# Altium project Do do am_Dk dong co_Hs1101.PrjPcb
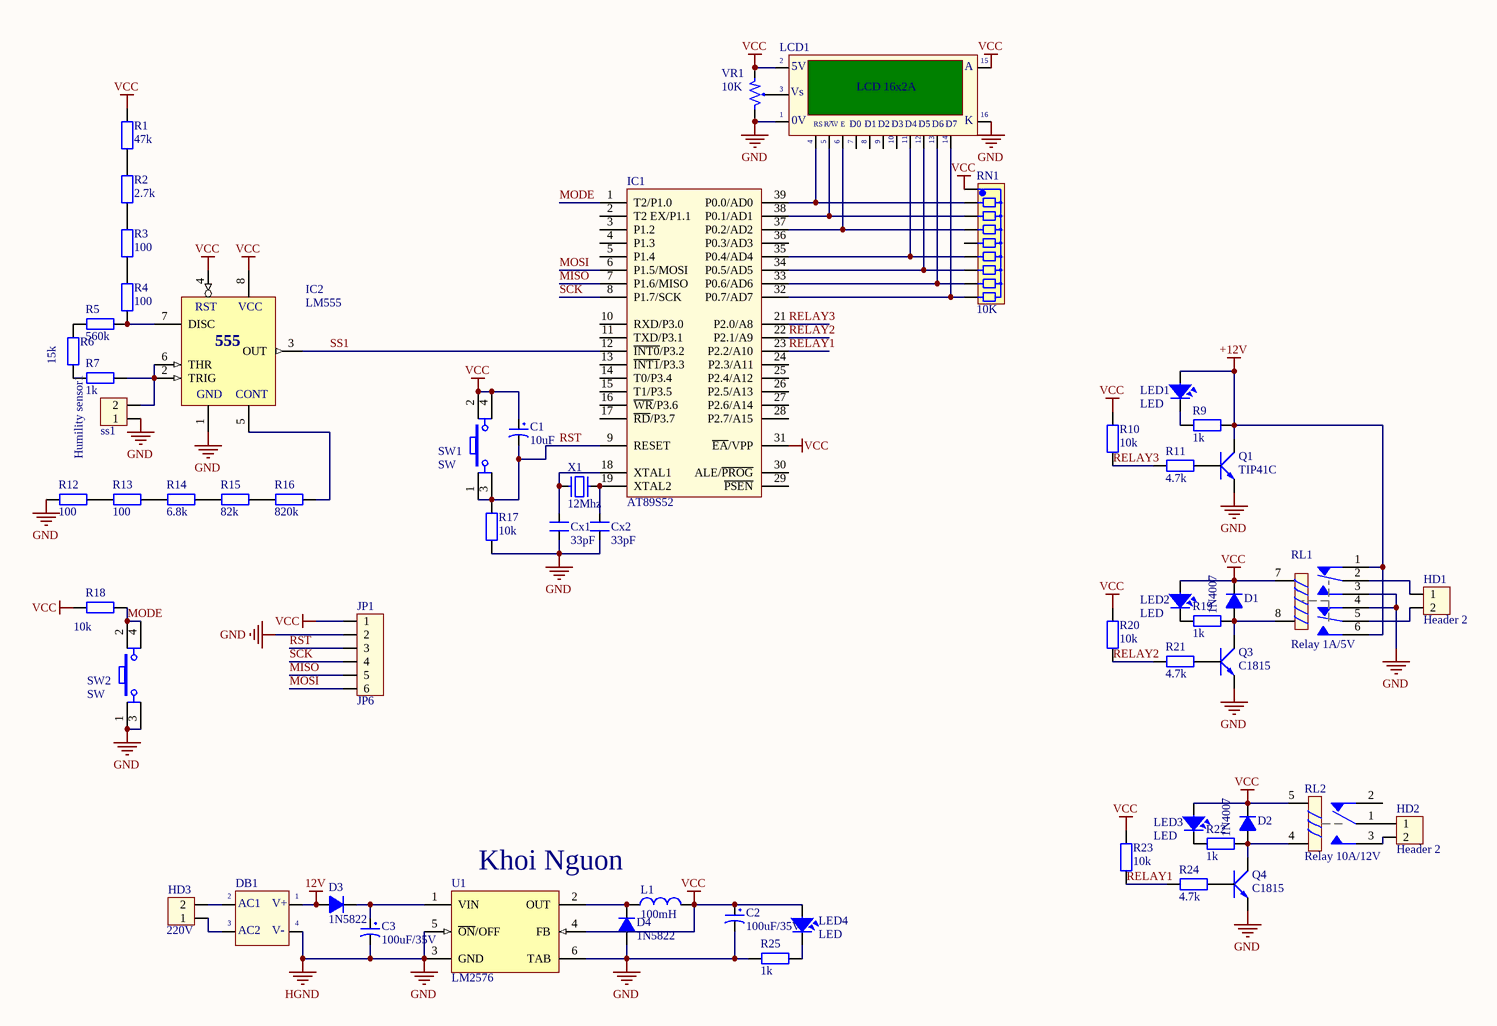
[diagram p0: nguyen ly.SchDoc]
1 sheet, 58 parts. Net scope: global (net labels, ports and power ports of the same name join across sheets).
Board file: Mach in.PcbDoc

## Sheet nguyen ly.SchDoc
size B

### Parts
C1  10uF  [CP1/2]
C2  100uF/35V  [CP1.5/3.4]
C3  100uF/35V  [CP1.5/3.4]
Cx1  33pF  [CN1]
Cx2  33pF  [CN1]
D1  1N4007  [D1A]
D2  1N4007  [D1A]
D3  1N5822  [D1A]
D4  1N5822  [D1A]
DB1  Diode Brideg  [CAU 1A]  (value not drawn)
HD1  Header 2  [HED2]
HD2  Header 2  [HED2]
HD3  220V  [HED2]
Humility_sensor1  ss1  [HED2]
IC1  AT89S52  [DIP40/W0.6]
IC2  LM555  [DIP8/W0.3]
JP1  JP6  [CON6]
L1  100mH  [L/0.4]
LCD1  LCD 16x2A  [LCD16X2]
LED1  LED  [LED-3]
LED2  LED  [LED-3]
LED3  LED  [LED-3]
LED4  LED  [LED-3]
Q1  TIP41C  [QTO-220]
Q3  C1815  [QTO-92]
Q4  C1815  [QTO-92]
R1  47k  [R1/4W]
R2  2.7k  [R1/4W]
R3  100  [R1/4W]
R4  100  [R1/4W]
R5  560k  [R1/4W]
R6  15k  [R1/4W]
R7  1k  [R1/4W]
R9  1k  [R1/4W]
R10  10k  [R1/4W]
R11  4.7k  [R1/4W]
R12  100  [R1/4W]
R13  100  [R1/4W]
R14  6.8k  [R1/4W]
R15  82k  [R1/4W]
R16  820k  [R1/4W]
R17  10k  [R1/4W]
R18  10k  [R1/4W]
R19  1k  [R1/4W]
R20  10k  [R1/4W]
R21  4.7k  [R1/4W]
R22  1k  [R1/4W]
R23  10k  [R1/4W]
R24  4.7k  [R1/4W]
R25  1k  [R1/4W]
RL1  Relay 1A/5V  [RL_DPDT_1A]
RL2  Relay 10A/12V  [RL_SPDT_10A]
RN1  10K  [RN8]
SW1  SW  [SW4]
SW2  SW  [SW4]
U1  LM2576  [TS5B_N]
VR1  10K  [VR]
X1  12Mhz  [XT2]

### Nets
12V: D3.1(A) DB1.1(+V_OUT)
+12V: LED1.1 Q1.2(C) R9.2 RL1.1 RL1.6
GND: C2.2 C3.2 Cx1.1 Cx2.1 D4.1(A) DB1.4(-V_OUT) Humility_sensor1.1 IC1.20(GND) IC2.1(GND) JP1.2 LCD1.1(GND) LCD1.16(K) Q1.3(E) Q3.1(E) Q4.1(E) R12.1 R17.1 R25.1 RL1.3 RL1.4 SW2.1 SW2.3 U1.3(GND) U1.5(~{ON}/OFF) U1.6(TAB) VR1.3  [also labelled HGND]
VCC: C1.1 C2.1 D1.2(K) D2.2(K) IC1.31(~{EA}/VPP) IC1.40(VCC) IC2.4(RST) IC2.8(VCC) JP1.1 L1.2 LCD1.2(VDD) LCD1.15(A) LED2.1 LED3.1 LED4.1 R1.2 R10.2 R18.2 R20.2 R23.2 RL1.7 RL2.5 RN1.1 SW1.2 SW1.4 U1.4(FB) VR1.1
MISO: IC1.7(P1.6/MISO) JP1.5
MODE: IC1.1(T2/P1.0) R18.1 SW2.2 SW2.4
MOSI: IC1.6(P1.5/MOSI) JP1.6
RELAY1: IC1.23(P2.2/A10) R23.1 R24.1
RELAY2: IC1.22(P2.1/A9) R20.1 R21.1
RELAY3: IC1.21(P2.0/A8) R10.1 R11.1
RST: C1.2 IC1.9(RESET) JP1.3 R17.2 SW1.1 SW1.3
SCK: IC1.8(P1.7/SCK) JP1.4
SS1: IC1.12(~{INT0}/P3.2) IC2.3(OUT)
NetC3_1: C3.1 D3.2(K) U1.1(VIN)
NetCx1_2: Cx1.2 IC1.18(XTAL1) X1.1
NetCx2_2: Cx2.2 IC1.19(XTAL2) X1.2
NetD1_1: D1.1(A) Q3.2(C) R19.2 RL1.8
NetD2_1: D2.1(A) Q4.2(C) R22.2 RL2.4
NetD4_2: D4.2(K) L1.1 U1.2(OUT)
NetDB1_2: DB1.2(AC1) HD3.2
NetDB1_3: DB1.3(AC2) HD3.1
NetHD1_1: HD1.1 RL1.2
NetHD1_2: HD1.2 RL1.5
NetHD2_1: HD2.1 RL2.1
NetHD2_2: HD2.2 RL2.3
NetHumility_sensor1_2: Humility_sensor1.2 IC2.2(TRIG) IC2.6(THR) R7.1
NetIC1_32: IC1.32(P0.7/AD7) LCD1.14(D7) RN1.9
NetIC1_33: IC1.33(P0.6/AD6) LCD1.13(D6) RN1.8
NetIC1_34: IC1.34(P0.5/AD5) LCD1.12(D5) RN1.7
NetIC1_35: IC1.35(P0.4/AD4) LCD1.11(D4) RN1.6
NetIC1_37: IC1.37(P0.2/AD2) LCD1.6(~{EN}) RN1.4
NetIC1_38: IC1.38(P0.1/AD1) LCD1.5(R/~{W}) RN1.3
NetIC1_39: IC1.39(P0.0/AD0) LCD1.4(RS) RN1.2
NetIC2_5: IC2.5(CONT) R16.2
NetIC2_7: IC2.7(DISC) R4.1 R5.1
NetLCD1_3: LCD1.3(VEE) VR1.2
NetLED1_2: LED1.2 R9.1
NetLED2_2: LED2.2 R19.1
NetLED3_2: LED3.2 R22.1
NetLED4_2: LED4.2 R25.2
NetQ1_1: Q1.1(B) R11.2
NetQ3_3: Q3.3(B) R21.2
NetQ4_3: Q4.3(B) R24.2
NetR1_1: R1.1 R2.2
NetR2_1: R2.1 R3.2
NetR3_1: R3.1 R4.2
NetR5_2: R5.2 R6.1
NetR6_2: R6.2 R7.2
NetR12_2: R12.2 R13.1
NetR13_2: R13.2 R14.1
NetR14_2: R14.2 R15.1
NetR15_2: R15.2 R16.1

Not connected (* = marked no-connect by the designer): IC1 2(T2_EX/P1.1) 3(P1.2) 4(P1.3) 5(P1.4) 10(RXD/P3.0) 11(TXD/P3.1) 13(~{INT1}/P3.3) 14(T0/P3.4) 15(T1/P3.5) 16(~{WR}/P3.6) 17(~{RD}/P3.7) 24(P2.3/A11) 25(P2.4/A12) 26(P2.5/A13) 27(P2.6/A14) 28(P2.7/A15) 29(~{PSEN}) 30(ALE/~{PROG}) 36(P0.3/AD3); LCD1 7(D0) 8(D1) 9(D2) 10(D3); RL2 2; RN1 5

### Notes on the sheet
- Khoi Nguon
- (in symbol DB) V+; V-
- (in symbol LCD16x2A) 5V; Vs; |; 0V; R/W; E
- (in symbol LM555) 555

### Library data of the parts
C1 = CP1: Cap P  0,1uF < 22uF , 16 - 50V; Value: 10uF/50V; Description 1: 10 => 220uF/6,3V/10V - 10uF => 100uF/16V; Description 2: 0,1uF => 33uF/50V - 10uF => 22uF/63V; Description 3: 0,47uF => 10uF/100V
C2 C3 = CP3: Cap 100uF/35V - 470uF/16V; Value: 100uF/35V/50V; Description 1: 1000uF/6,3V - 470uF/16V - 330uF - 25V; Description 2: 220uF/35V - 100uF/50V - 63V - 4,7uF/200V; Description 3: 22uF => 33uF100V - 3,3uF => 4,7uF/250V; Description 4: 2,2uF =>3,3uF/350 - 2,2uF/400V - 1uF/450V
Cx1 Cx2 = CN0: Cremic For Xtal 1pF => 100pF; Description: Cap np Cremic value 1pF => 100pF; Value: 33pF
D1 D2 = D1A: Diode 1A; Value: 1N4007
D3 D4 = D1A: Diode 1A; Value: 1N4007
DB1 = DB: Convert AC to DC voltage, 4 pin; Value: Cau 1A
HD1-HD3 Humility_sensor1 = Hed2: Header 2 (Green); Value: Header 2
IC1 = AT89S52: AT89S52, 8k Byte Flash Memory , 40 Pin; Value: AT89S52
IC2 = LM555: Timer; Value: LM555
JP1 = Con6: Connector 6; Value: Connector 6
L1 = L1: Inductor; Value: 150 mH
LCD1 = LCD16x2A: LCD dipslay 16 char, 2 line; Value: LCD16x2A
LED1-LED4 = LED: LED Single colour Green and Red; Value: LED 3 ly Single Colour; Description: LED 5 ly Single Colour; Description: Led  Vuong
Q1 = TIP41C: NPN 2W, BCE; Value: TIP41C
Q3 Q4 = C1815: NPN 600mW, ECB; Value: C1815
R1-R7 R9-R25 = R1/4W: Resistor 1/4W; Value: R1/4W - 1K
RL1 = Relay 2: Relay DPDT; Discription: Relay DPDT 5V, 12V - 1A - 5A; Value: Relay - 5V - 1A
RL2 = Relay 1: Relay SPDT,10A - 12VDC 5 Pin; Value: Relay SPDT, 10A, 12V
RN1 = RN8: Resistor 8 (Thanh); Value: Tro thanh 10K
SW1 SW2 = SW4: Switch button 4 pin; Value: Button chip 4 pin
VR1 = VR1: Var Resistor; Value: VR 10K
X1 = XT2: Crystal For all Crystal 2pin.; Value: 4Mhz